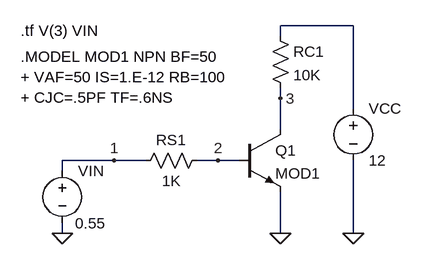
[diagram p0: schematic Fig_3-17_TF.asc]
Fig_3-17_TF.asc, the LTspice schematic file:
Version 4
SHEET 1 4496 832
WIRE 272 -64 160 -64
WIRE 160 -48 160 -64
WIRE 160 48 160 32
WIRE 272 64 272 -64
WIRE 160 96 160 48
WIRE -96 144 -176 144
WIRE -48 144 -96 144
WIRE 64 144 32 144
WIRE 96 144 64 144
WIRE -176 160 -176 144
WIRE -176 256 -176 240
WIRE 160 256 160 192
WIRE 272 256 272 144
FLAG 272 256 0
FLAG -176 256 0
FLAG -96 144 1
FLAG 64 144 2
FLAG 160 48 3
FLAG 160 256 0
SYMBOL voltage 272 48 R0
SYMATTR InstName VCC
SYMATTR Value 12
SYMBOL voltage -176 144 R0
WINDOW 3 20 97 Left 2
WINDOW 123 24 132 Left 2
WINDOW 39 0 0 Left 2
SYMATTR Value 0.55
SYMATTR InstName VIN
SYMBOL npn 96 96 R0
SYMATTR InstName Q1
SYMATTR Value MOD1
SYMBOL res 144 -64 R0
SYMATTR InstName RC1
SYMATTR Value 10K
SYMBOL res -64 160 R270
WINDOW 0 32 56 VTop 2
WINDOW 3 0 56 VBottom 2
SYMATTR InstName RS1
SYMATTR Value 1K
TEXT -240 -56 Left 2 !.tf V(3) VIN
TEXT -240 -16 Left 2 !.MODEL MOD1 NPN BF=50\n+ VAF=50 IS=1.E-12 RB=100\n+ CJC=.5PF TF=.6NS

The netlist it stands for:
* Fig_3-17_TF.asc
VCC N001 0 12
VIN 1 0 0.55
Q1 3 2 0 0 MOD1
RC1 N001 3 10K
RS1 1 2 1K
.model NPN NPN
.model PNP PNP
.lib standard.bjt
.tf V(3) VIN
.MODEL MOD1 NPN BF=50
+ VAF=50 IS=1.E-12 RB=100
+ CJC=.5PF TF=.6NS
.backanno
.end